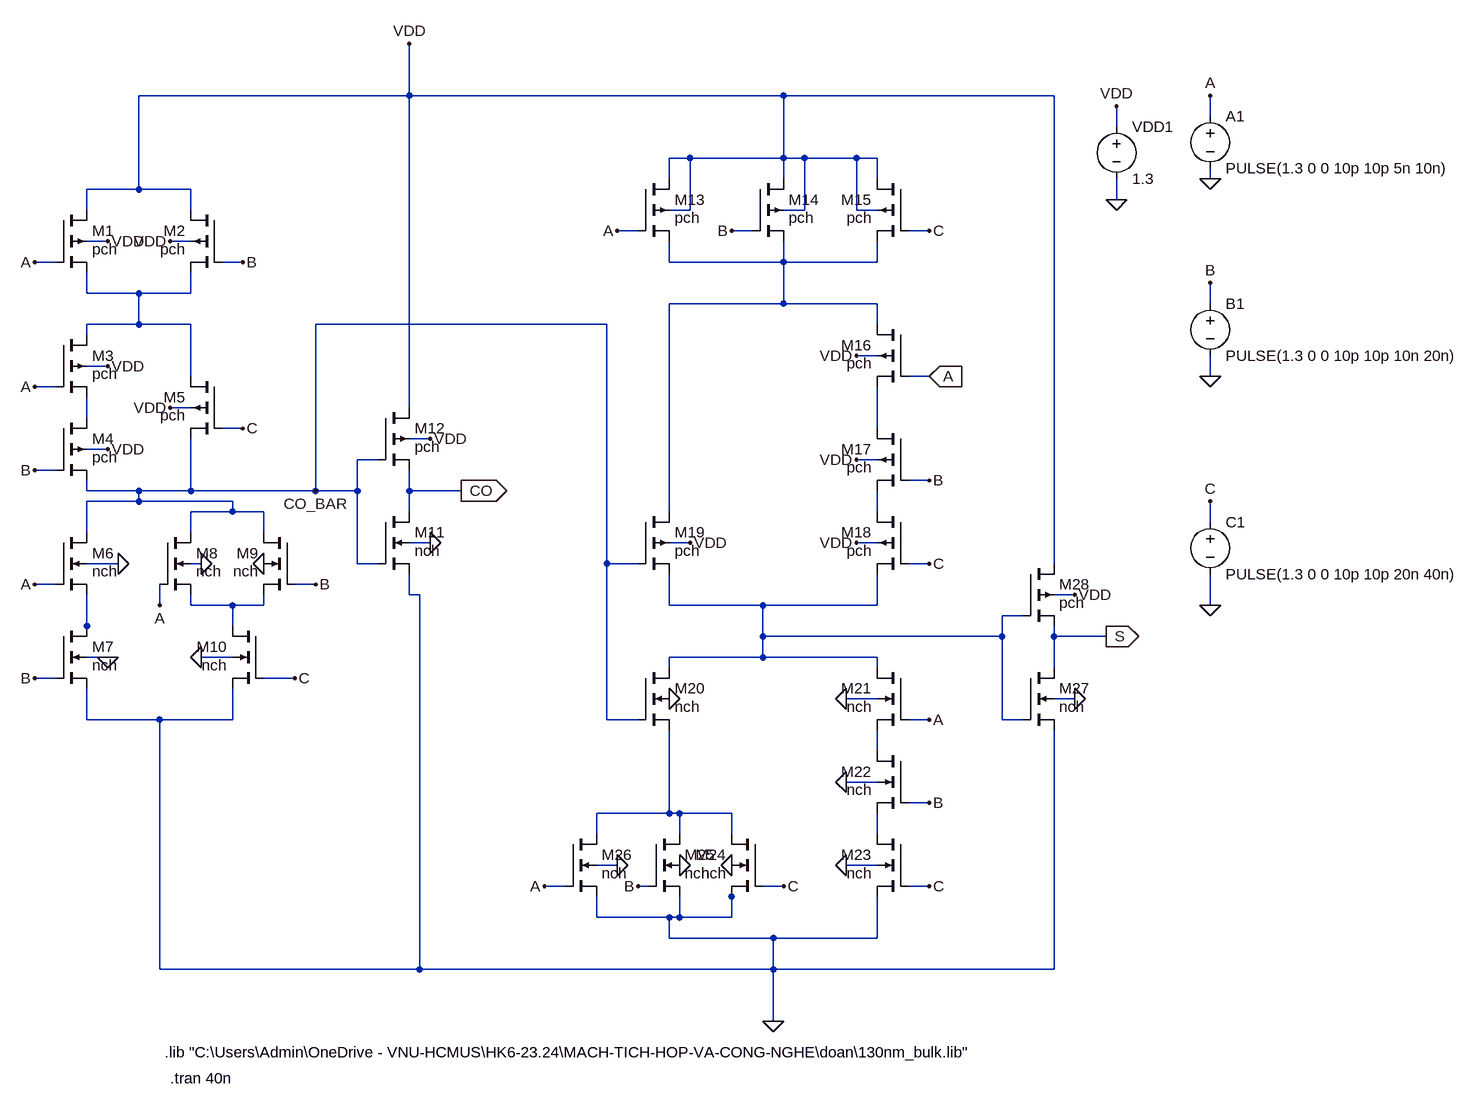
[diagram p0: schematic Draft1.asc]
Draft1.asc, the LTspice schematic file:
Version 4
SHEET 1 2012 1000
WIRE 240 -528 240 -608
WIRE 240 -528 -176 -528
WIRE 816 -528 240 -528
WIRE 1232 -528 816 -528
WIRE 1472 -496 1472 -528
WIRE 1328 -480 1328 -512
WIRE 672 -432 640 -432
WIRE 816 -432 816 -528
WIRE 816 -432 672 -432
WIRE 848 -432 816 -432
WIRE 928 -432 848 -432
WIRE 960 -432 928 -432
WIRE 640 -400 640 -432
WIRE 816 -400 816 -432
WIRE 960 -400 960 -432
WIRE 1472 -400 1472 -416
WIRE -176 -384 -176 -528
WIRE -176 -384 -256 -384
WIRE -96 -384 -176 -384
WIRE 1328 -368 1328 -400
WIRE -256 -352 -256 -384
WIRE -96 -352 -96 -384
WIRE 672 -352 672 -432
WIRE 672 -352 640 -352
WIRE 848 -352 848 -432
WIRE 848 -352 816 -352
WIRE 928 -352 928 -432
WIRE 960 -352 928 -352
WIRE 592 -320 560 -320
WIRE 768 -320 736 -320
WIRE 1040 -320 1008 -320
WIRE -224 -304 -256 -304
WIRE -96 -304 -128 -304
WIRE -304 -272 -336 -272
WIRE -16 -272 -48 -272
WIRE 640 -272 640 -304
WIRE 816 -272 816 -304
WIRE 816 -272 640 -272
WIRE 960 -272 960 -304
WIRE 960 -272 816 -272
WIRE -256 -224 -256 -256
WIRE -176 -224 -256 -224
WIRE -96 -224 -96 -256
WIRE -96 -224 -176 -224
WIRE 816 -208 816 -272
WIRE 816 -208 640 -208
WIRE 960 -208 816 -208
WIRE 1472 -208 1472 -240
WIRE -176 -176 -176 -224
WIRE -176 -176 -256 -176
WIRE -96 -176 -176 -176
WIRE 544 -176 96 -176
WIRE 960 -176 960 -208
WIRE -256 -160 -256 -176
WIRE 960 -128 928 -128
WIRE -224 -112 -256 -112
WIRE -96 -96 -96 -176
WIRE 1040 -96 1008 -96
WIRE 1472 -96 1472 -128
WIRE -304 -80 -336 -80
WIRE -96 -48 -128 -48
WIRE 240 -48 240 -528
WIRE -256 -32 -256 -64
WIRE -16 -16 -48 -16
WIRE 960 -16 960 -80
WIRE 272 0 240 0
WIRE -224 16 -256 16
WIRE 192 32 160 32
WIRE 960 32 928 32
WIRE -304 48 -336 48
WIRE 1040 64 1008 64
WIRE -256 80 -256 64
WIRE -176 80 -256 80
WIRE -96 80 -96 0
WIRE -96 80 -176 80
WIRE 96 80 96 -176
WIRE 96 80 -96 80
WIRE 160 80 160 32
WIRE 160 80 96 80
WIRE 240 80 240 48
WIRE 320 80 240 80
WIRE -176 96 -176 80
WIRE -176 96 -256 96
WIRE -32 96 -176 96
WIRE -32 112 -32 96
WIRE -32 112 -96 112
WIRE 16 112 -32 112
WIRE 240 112 240 80
WIRE 640 112 640 -208
WIRE 960 112 960 80
WIRE 1472 128 1472 96
WIRE -256 144 -256 96
WIRE -96 144 -96 112
WIRE 16 144 16 112
WIRE 272 160 240 160
WIRE 672 160 640 160
WIRE 960 160 928 160
WIRE -208 192 -256 192
WIRE -80 192 -96 192
WIRE 160 192 160 80
WIRE 192 192 160 192
WIRE 544 192 544 -176
WIRE 592 192 544 192
WIRE 1040 192 1008 192
WIRE 1232 192 1232 -528
WIRE -304 224 -336 224
WIRE 96 224 64 224
WIRE 240 240 240 208
WIRE 256 240 240 240
WIRE 1264 240 1232 240
WIRE -144 256 -144 224
WIRE -96 256 -96 240
WIRE -32 256 -96 256
WIRE 16 256 16 240
WIRE 16 256 -32 256
WIRE 640 256 640 208
WIRE 784 256 640 256
WIRE 960 256 960 208
WIRE 960 256 784 256
WIRE 1472 256 1472 208
WIRE 1184 272 1152 272
WIRE -256 288 -256 240
WIRE -32 288 -32 256
WIRE -256 304 -256 288
WIRE 784 304 784 256
WIRE 1152 304 1152 272
WIRE 1152 304 784 304
WIRE 1232 304 1232 288
WIRE 1312 304 1232 304
WIRE -224 336 -256 336
WIRE -208 336 -224 336
WIRE -32 336 -80 336
WIRE 784 336 784 304
WIRE 784 336 640 336
WIRE 960 336 784 336
WIRE 640 352 640 336
WIRE 960 352 960 336
WIRE 1232 352 1232 304
WIRE -304 368 -336 368
WIRE 64 368 16 368
WIRE 960 400 912 400
WIRE 1264 400 1232 400
WIRE -256 432 -256 384
WIRE -144 432 -256 432
WIRE -32 432 -32 384
WIRE -32 432 -144 432
WIRE 544 432 544 192
WIRE 592 432 544 432
WIRE 1040 432 1008 432
WIRE 1152 432 1152 304
WIRE 1184 432 1152 432
WIRE 960 480 960 448
WIRE 960 528 912 528
WIRE 1040 560 1008 560
WIRE 640 576 640 448
WIRE 640 576 528 576
WIRE 656 576 640 576
WIRE 736 576 656 576
WIRE 528 608 528 576
WIRE 656 608 656 576
WIRE 736 608 736 576
WIRE 960 608 960 576
WIRE 560 656 528 656
WIRE 960 656 912 656
WIRE 480 688 448 688
WIRE 608 688 592 688
WIRE 816 688 784 688
WIRE 1040 688 1008 688
WIRE 736 704 736 688
WIRE 528 736 528 704
WIRE 640 736 528 736
WIRE 656 736 656 704
WIRE 656 736 640 736
WIRE 736 736 736 704
WIRE 736 736 656 736
WIRE 640 768 640 736
WIRE 800 768 640 768
WIRE 960 768 960 704
WIRE 960 768 800 768
WIRE -144 816 -144 432
WIRE 256 816 256 240
WIRE 256 816 -144 816
WIRE 800 816 800 768
WIRE 800 816 256 816
WIRE 1232 816 1232 448
WIRE 1232 816 800 816
WIRE 800 896 800 816
FLAG -336 -272 A
FLAG -16 -272 B
FLAG -336 -80 A
FLAG -16 -16 C
FLAG -336 48 B
FLAG 96 80 CO_BAR
FLAG -336 224 A
FLAG -144 256 A
FLAG 96 224 B
FLAG -336 368 B
FLAG 64 368 C
FLAG 320 80 CO
IOPIN 320 80 Out
FLAG 800 896 0
FLAG 560 -320 A
FLAG 736 -320 B
FLAG 1040 -320 C
FLAG 1040 -96 A
IOPIN 1040 -96 In
FLAG 1040 64 B
FLAG 1040 192 C
FLAG 1040 432 A
FLAG 1040 560 B
FLAG 1040 688 C
FLAG 816 688 C
FLAG 592 688 B
FLAG 448 688 A
FLAG 1312 304 S
IOPIN 1312 304 Out
FLAG 240 -608 VDD
FLAG 1472 256 0
FLAG 1472 -96 0
FLAG 1472 -400 0
FLAG 1328 -368 0
FLAG 1328 -512 VDD
FLAG 1472 -528 A
FLAG 1472 -240 B
FLAG 1472 96 C
FLAG -224 -304 VDD
FLAG -128 -304 VDD
FLAG -224 -112 VDD
FLAG -128 -48 VDD
FLAG -224 16 VDD
FLAG 272 0 VDD
FLAG 928 -128 VDD
FLAG 928 32 VDD
FLAG 928 160 VDD
FLAG 672 160 VDD
FLAG 272 160 0
FLAG -80 192 0
FLAG 16 192 0
FLAG -208 192 0
FLAG -224 336 0
FLAG -80 336 0
FLAG 640 400 0
FLAG 912 400 0
FLAG 912 528 0
FLAG 560 656 0
FLAG 656 656 0
FLAG 736 656 0
FLAG 912 656 0
FLAG 1264 400 0
FLAG 1264 240 VDD
SYMBOL pmos4 -304 -352 R0
WINDOW 3 56 60 Left 2
SYMATTR Value pch
SYMATTR InstName M1
SYMATTR Value2 l=130n w=0.78u
SYMBOL pmos4 -48 -352 M0
WINDOW 3 56 60 Left 2
SYMATTR Value pch
SYMATTR InstName M2
SYMATTR Value2 l=130n w=0.78u
SYMBOL pmos4 -304 -160 R0
WINDOW 3 56 60 Left 2
SYMATTR Value pch
SYMATTR InstName M3
SYMATTR Value2 l=130n w=0.78u
SYMBOL pmos4 -304 -32 R0
WINDOW 3 56 60 Left 2
SYMATTR Value pch
SYMATTR InstName M4
SYMATTR Value2 l=130n w=0.78u
SYMBOL pmos4 -48 -96 M0
WINDOW 3 56 60 Left 2
SYMATTR Value pch
SYMATTR InstName M5
SYMATTR Value2 l=130n w=0.39u
SYMBOL nmos4 -304 144 R0
WINDOW 3 56 60 Left 2
SYMATTR Value nch
SYMATTR InstName M6
SYMATTR Value2 l=130n w=0.26u
SYMBOL nmos4 -304 288 R0
WINDOW 3 56 60 Left 2
SYMATTR Value nch
SYMATTR InstName M7
SYMATTR Value2 l=130n w=0.26u
SYMBOL nmos4 -144 144 R0
WINDOW 3 56 60 Left 2
SYMATTR Value nch
SYMATTR InstName M8
SYMATTR Value2 l=130n w=0.26u
SYMBOL nmos4 64 144 M0
WINDOW 3 56 60 Left 2
SYMATTR Value nch
SYMATTR InstName M9
SYMATTR Value2 l=130n w=0.26u
SYMBOL nmos4 16 288 M0
WINDOW 3 56 60 Left 2
SYMATTR Value nch
SYMATTR InstName M10
SYMATTR Value2 l=130n w=0.26u
SYMBOL nmos4 192 112 R0
WINDOW 3 56 60 Left 2
SYMATTR Value nch
SYMATTR InstName M11
SYMATTR Value2 l=130n w=130n
SYMBOL pmos4 192 -48 R0
WINDOW 3 56 60 Left 2
SYMATTR Value pch
SYMATTR InstName M12
SYMATTR Value2 l=130n w=0.26u
SYMBOL pmos4 592 -400 R0
WINDOW 3 56 60 Left 2
SYMATTR Value pch
SYMATTR InstName M13
SYMATTR Value2 l=130n w=1.08u
SYMBOL pmos4 768 -400 R0
WINDOW 3 56 60 Left 2
SYMATTR Value pch
SYMATTR InstName M14
SYMATTR Value2 l=130n w=1.08u
SYMBOL pmos4 1008 -400 M0
WINDOW 3 56 60 Left 2
SYMATTR Value pch
SYMATTR InstName M15
SYMATTR Value2 l=130n w=1.08u
SYMBOL pmos4 1008 -176 M0
WINDOW 3 56 60 Left 2
SYMATTR Value pch
SYMATTR InstName M16
SYMATTR Value2 l=130n w=1.08u
SYMBOL pmos4 1008 -16 M0
WINDOW 3 56 60 Left 2
SYMATTR Value pch
SYMATTR InstName M17
SYMATTR Value2 l=130n w=1.08u
SYMBOL pmos4 1008 112 M0
WINDOW 3 56 60 Left 2
SYMATTR Value pch
SYMATTR InstName M18
SYMATTR Value2 l=130n w=1.08u
SYMBOL pmos4 592 112 R0
WINDOW 3 56 60 Left 2
SYMATTR Value pch
SYMATTR InstName M19
SYMATTR Value2 l=130n w=0.52u
SYMBOL nmos4 592 352 R0
WINDOW 3 56 60 Left 2
SYMATTR Value nch
SYMATTR InstName M20
SYMATTR Value2 l=130n w=0.26u
SYMBOL nmos4 1008 352 M0
WINDOW 3 56 60 Left 2
SYMATTR Value nch
SYMATTR InstName M21
SYMATTR Value2 l=130n w=0.39u
SYMBOL nmos4 1008 480 M0
WINDOW 3 56 60 Left 2
SYMATTR Value nch
SYMATTR InstName M22
SYMATTR Value2 l=130n w=0.39u
SYMBOL nmos4 1008 608 M0
WINDOW 3 56 60 Left 2
SYMATTR Value nch
SYMATTR InstName M23
SYMATTR Value2 l=130n w=0.39u
SYMBOL nmos4 784 608 M0
WINDOW 3 56 60 Left 2
SYMATTR Value nch
SYMATTR InstName M24
SYMATTR Value2 l=130n w=0.26u
SYMBOL nmos4 608 608 R0
WINDOW 3 56 60 Left 2
SYMATTR Value nch
SYMATTR InstName M25
SYMATTR Value2 l=130n w=0.26u
SYMBOL nmos4 480 608 R0
WINDOW 3 56 60 Left 2
SYMATTR Value nch
SYMATTR InstName M26
SYMATTR Value2 l=130n w=0.26u
SYMBOL nmos4 1184 352 R0
WINDOW 3 56 60 Left 2
SYMATTR Value nch
SYMATTR InstName M27
SYMATTR Value2 l=130n w=130n
SYMBOL pmos4 1184 192 R0
WINDOW 3 56 60 Left 2
SYMATTR Value pch
SYMATTR InstName M28
SYMATTR Value2 l=130n w=0.26u
SYMBOL voltage 1472 -512 R0
WINDOW 123 0 0 Left 0
WINDOW 39 0 0 Left 0
SYMATTR InstName A1
SYMATTR Value PULSE(1.3 0 0 10p 10p 5n 10n)
SYMBOL voltage 1472 -224 R0
WINDOW 123 0 0 Left 0
WINDOW 39 0 0 Left 0
SYMATTR InstName B1
SYMATTR Value PULSE(1.3 0 0 10p 10p 10n 20n)
SYMBOL voltage 1472 112 R0
WINDOW 123 0 0 Left 0
WINDOW 39 0 0 Left 0
SYMATTR InstName C1
SYMATTR Value PULSE(1.3 0 0 10p 10p 20n 40n)
SYMBOL voltage 1328 -496 R0
WINDOW 123 0 0 Left 0
WINDOW 39 0 0 Left 0
SYMATTR InstName VDD1
SYMATTR Value 1.3
TEXT -128 984 Left 2 !.tran 40n
TEXT -136 944 Left 2 !.lib "C:\\Users\\Admin\\OneDrive - VNU-HCMUS\\HK6-23.24\\MACH-TICH-HOP-VA-CONG-NGHE\\doan\\130nm_bulk.lib"

The netlist it stands for:
* Draft1.asc
M1 VDD A N002 VDD pch l=130n w=0.78u
M2 VDD B N002 VDD pch l=130n w=0.78u
M3 N002 A N003 VDD pch l=130n w=0.78u
M4 N003 B CO_BAR VDD pch l=130n w=0.78u
M5 N002 C CO_BAR VDD pch l=130n w=0.39u
M6 CO_BAR A N008 0 nch l=130n w=0.26u
M7 N008 B 0 0 nch l=130n w=0.26u
M8 CO_BAR A N006 0 nch l=130n w=0.26u
M9 CO_BAR B N006 0 nch l=130n w=0.26u
M10 N006 C 0 0 nch l=130n w=0.26u
M11 CO CO_BAR 0 0 nch l=130n w=130n
M12 VDD CO_BAR CO VDD pch l=130n w=0.26u
M13 VDD A N001 VDD pch l=130n w=1.08u
M14 VDD B N001 VDD pch l=130n w=1.08u
M15 VDD C N001 VDD pch l=130n w=1.08u
M16 N001 A N004 VDD pch l=130n w=1.08u
M17 N004 B N005 VDD pch l=130n w=1.08u
M18 N005 C N007 VDD pch l=130n w=1.08u
M19 N001 CO_BAR N007 VDD pch l=130n w=0.52u
M20 N007 CO_BAR N010 0 nch l=130n w=0.26u
M21 N007 A N009 0 nch l=130n w=0.39u
M22 N009 B N011 0 nch l=130n w=0.39u
M23 N011 C 0 0 nch l=130n w=0.39u
M24 N010 C 0 0 nch l=130n w=0.26u
M25 N010 B 0 0 nch l=130n w=0.26u
M26 N010 A 0 0 nch l=130n w=0.26u
M27 S N007 0 0 nch l=130n w=130n
M28 VDD N007 S VDD pch l=130n w=0.26u
V§A1 A 0 PULSE(1.3 0 0 10p 10p 5n 10n)
V§B1 B 0 PULSE(1.3 0 0 10p 10p 10n 20n)
V§C1 C 0 PULSE(1.3 0 0 10p 10p 20n 40n)
VDD1 VDD 0 1.3
.model NMOS NMOS
.model PMOS PMOS
.lib standard.mos
.tran 40n
.lib "C:\Users\Admin\OneDrive - VNU-HCMUS\HK6-23.24\MACH-TICH-HOP-VA-CONG-NGHE\doan\130nm_bulk.lib"
.backanno
.end